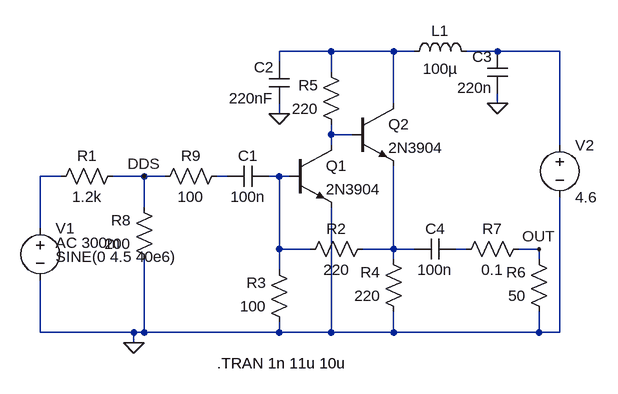
[diagram p0: schematic buffer.asc]
buffer.asc, the LTspice schematic file:
Version 4
SHEET 1 964 680
WIRE 480 -16 400 -16
WIRE 576 -16 480 -16
WIRE 608 -16 576 -16
WIRE 736 -16 688 -16
WIRE 832 -16 736 -16
WIRE 400 0 400 -16
WIRE 480 16 480 -16
WIRE 576 64 576 -16
WIRE 736 64 736 48
WIRE 400 80 400 64
WIRE 480 112 480 96
WIRE 512 112 480 112
WIRE 480 128 480 112
WIRE 832 128 832 -16
WIRE 64 176 32 176
WIRE 192 176 144 176
WIRE 224 176 192 176
WIRE 320 176 304 176
WIRE 400 176 384 176
WIRE 416 176 400 176
WIRE 192 224 192 176
WIRE 32 256 32 176
WIRE 400 288 400 176
WIRE 448 288 400 288
WIRE 576 288 576 160
WIRE 576 288 528 288
WIRE 608 288 576 288
WIRE 688 288 672 288
WIRE 800 288 768 288
WIRE 576 304 576 288
WIRE 800 304 800 288
WIRE 400 320 400 288
WIRE 32 416 32 336
WIRE 176 416 32 416
WIRE 192 416 192 304
WIRE 192 416 176 416
WIRE 400 416 400 400
WIRE 400 416 192 416
WIRE 480 416 480 224
WIRE 480 416 400 416
WIRE 576 416 576 384
WIRE 576 416 480 416
WIRE 800 416 800 384
WIRE 800 416 576 416
WIRE 832 416 832 208
WIRE 832 416 800 416
WIRE 176 432 176 416
FLAG 400 80 0
FLAG 736 64 0
FLAG 176 432 0
FLAG 192 176 DDS
FLAG 800 288 OUT
SYMBOL voltage 32 240 R0
WINDOW 3 24 60 Left 2
WINDOW 123 24 38 Left 2
SYMATTR Value SINE(0 4.5 40e6)
SYMATTR Value2 AC 300m
SYMATTR InstName V1
SYMBOL res 160 160 R90
WINDOW 0 0 56 VBottom 2
WINDOW 3 32 56 VTop 2
SYMATTR InstName R1
SYMATTR Value 1.2k
SYMBOL res 544 272 R90
WINDOW 0 0 56 VBottom 2
WINDOW 3 32 56 VTop 2
SYMATTR InstName R2
SYMATTR Value 220
SYMBOL res 416 416 R180
WINDOW 0 36 76 Left 2
WINDOW 3 36 40 Left 2
SYMATTR InstName R3
SYMATTR Value 100
SYMBOL res 592 400 R180
WINDOW 0 36 76 Left 2
WINDOW 3 36 40 Left 2
SYMATTR InstName R4
SYMATTR Value 220
SYMBOL res 496 112 R180
WINDOW 0 36 76 Left 2
WINDOW 3 36 40 Left 2
SYMATTR InstName R5
SYMATTR Value 220
SYMBOL res 816 400 R180
WINDOW 0 36 76 Left 2
WINDOW 3 36 40 Left 2
SYMATTR InstName R6
SYMATTR Value 50
SYMBOL cap 384 160 R90
WINDOW 0 0 32 VBottom 2
WINDOW 3 32 32 VTop 2
SYMATTR InstName C1
SYMATTR Value 100n
SYMBOL cap 416 64 R180
WINDOW 0 24 56 Left 2
WINDOW 3 24 8 Left 2
SYMATTR InstName C2
SYMATTR Value 220nF
SYMBOL cap 752 48 R180
WINDOW 0 24 56 Left 2
WINDOW 3 24 8 Left 2
SYMATTR InstName C3
SYMATTR Value 220n
SYMBOL cap 608 304 R270
WINDOW 0 32 32 VTop 2
WINDOW 3 0 32 VBottom 2
SYMATTR InstName C4
SYMATTR Value 100n
SYMBOL npn 416 128 R0
SYMATTR InstName Q1
SYMATTR Value 2N3904
SYMBOL npn 512 64 R0
SYMATTR InstName Q2
SYMATTR Value 2N3904
SYMBOL ind 592 0 R270
WINDOW 0 32 56 VTop 2
WINDOW 3 5 56 VBottom 2
SYMATTR InstName L1
SYMATTR Value 100µ
SYMBOL voltage 832 112 R0
SYMATTR InstName V2
SYMATTR Value 4.6
SYMBOL res 672 304 R270
WINDOW 0 32 56 VTop 2
WINDOW 3 0 56 VBottom 2
SYMATTR InstName R7
SYMATTR Value 0.1
SYMBOL res 208 320 R180
WINDOW 0 36 76 Left 2
WINDOW 3 36 40 Left 2
SYMATTR InstName R8
SYMATTR Value 200
SYMBOL res 320 160 R90
WINDOW 0 0 56 VBottom 2
WINDOW 3 32 56 VTop 2
SYMATTR InstName R9
SYMATTR Value 100
TEXT 304 464 Left 2 !.TRAN 1n 11u 10u

The netlist it stands for:
* buffer.asc
V1 N004 0 SINE(0 4.5 40e6) AC 300m
R1 DDS N004 1.2k
R2 N007 N006 220
R3 0 N006 100
R4 0 N007 220
R5 N003 N001 220
R6 0 OUT 50
C1 N006 N005 100n
C2 0 N001 220nF
C3 0 N002 220n
C4 N007 N008 100n
Q1 N003 N006 0 0 2N3904
Q2 N001 N003 N007 0 2N3904
L1 N001 N002 100µ
V2 N002 0 4.6
R7 N008 OUT 0.1
R8 0 DDS 200
R9 N005 DDS 100
.model NPN NPN
.model PNP PNP
.lib standard.bjt
.TRAN 1n 11u 10u
.backanno
.end